# EAGLE design 0HP 0ttenuator Final (EAGLE 9.2.0)
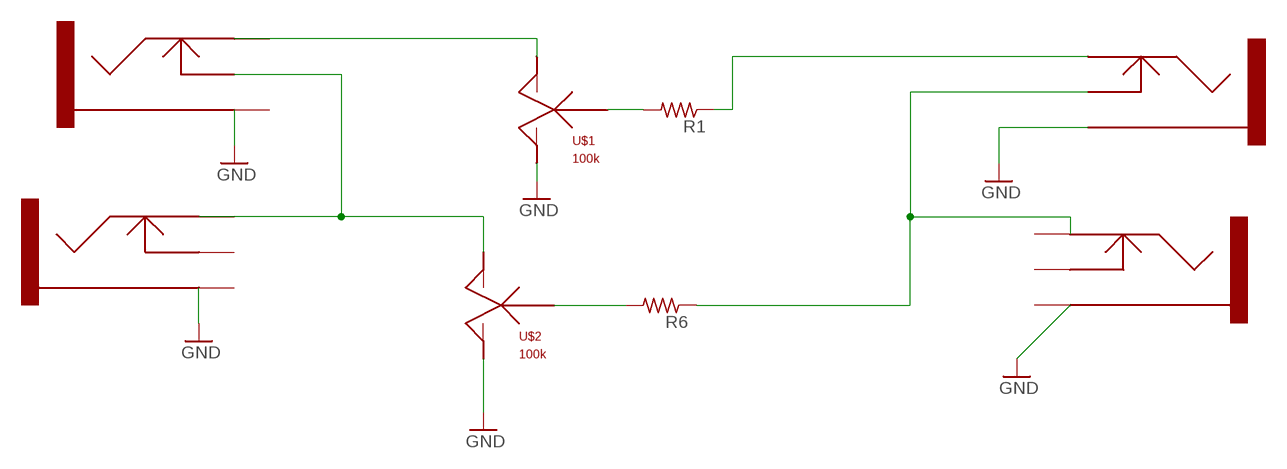
[diagram p0: schematic, sheet 1]

## Parts
CV1  3.5MMJACK  [3.5MMPHONEJACK]
CV2  3.5MMJACK  [3.5MMPHONEJACK]
IN  3.5MMJACK  [3.5MMPHONEJACK]
OUT  3.5MMJACK  [3.5MMPHONEJACK]
R1  R-US_0207/10  [0207/10]
R6  R-US_0207/10  [0207/10]
U$1  100k  ALPHAPOT_BOARDMOUNT  [ALPHAPOT_BOARDMOUNT]
U$2  100k  ALPHAPOT_BOARDMOUNT  [ALPHAPOT_BOARDMOUNT]

## Nets
GND: CV1.SLEEVE CV2.SLEEVE IN.SLEEVE OUT.SLEEVE U$1.RIGHT U$2.RIGHT
N$2: CV2.TIP U$1.LEFT
N$3: R1.2 U$1.MID
N$5: CV1.TIP CV2.SWITCH U$2.LEFT
N$6: OUT.TIP R1.1
N$7: IN.TIP OUT.SWITCH R6.1
N$8: R6.2 U$2.MID
Unconnected: CV1.SWITCH IN.SWITCH

## Library data of the parts
CV1 CV2 IN OUT = elipech_modified:3.5MMJACK
R1 R6 = rcl:R-US_: RESISTOR, American symbol; SPICEPREFIX: R
U$1 U$2 = elipech_modified:ALPHAPOT_BOARDMOUNT

## Board
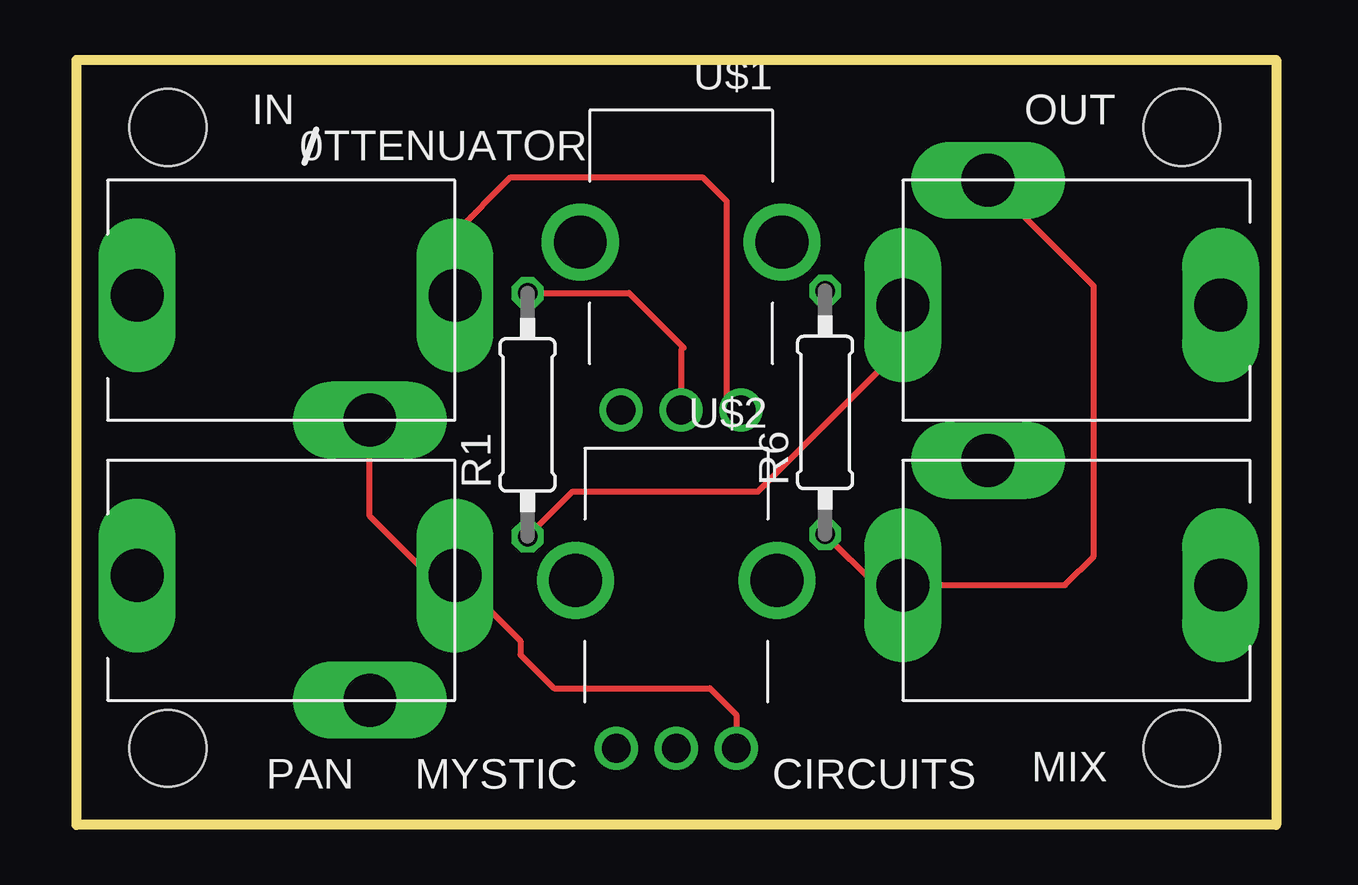
[diagram p1: board, top side]
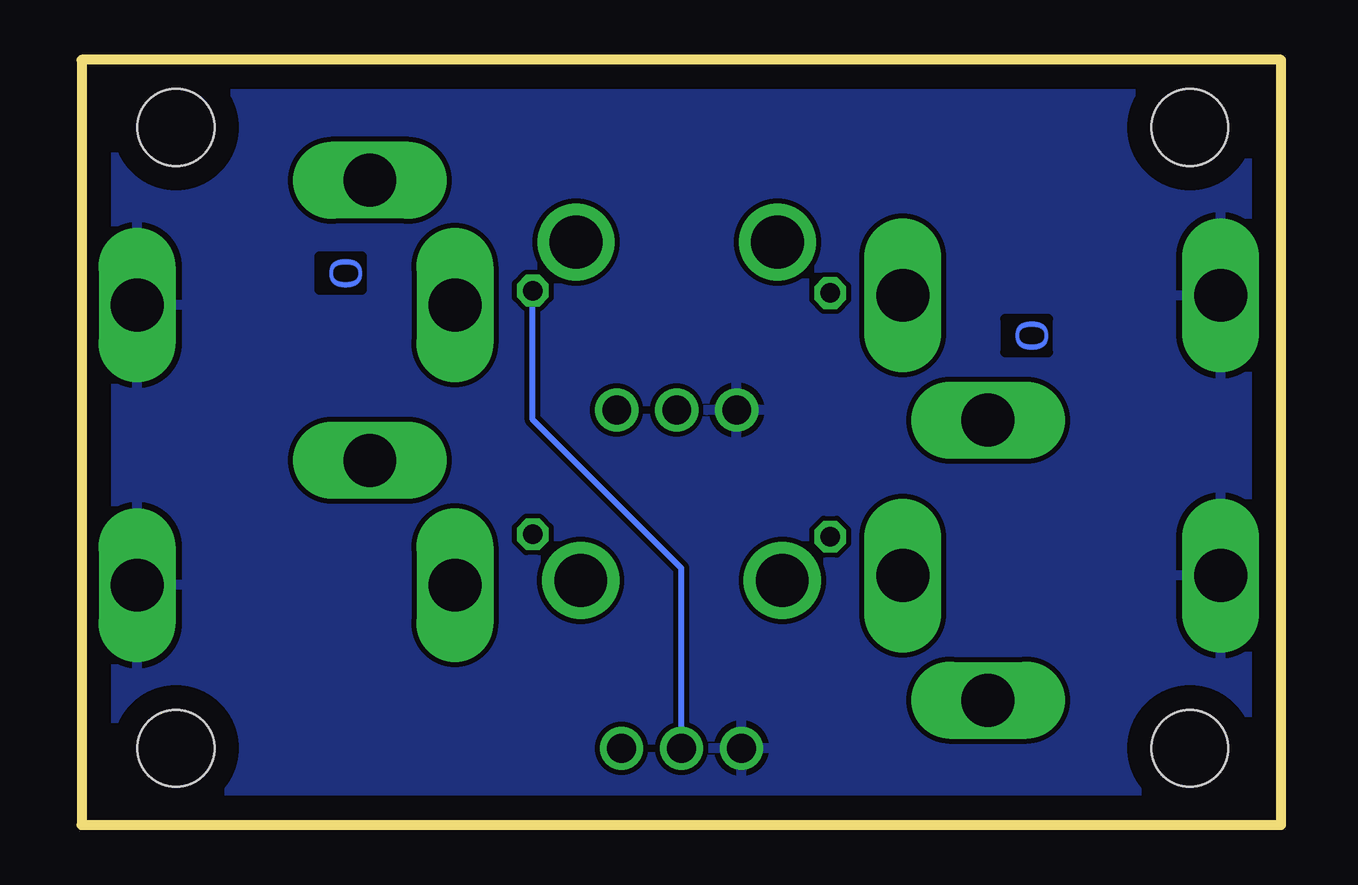
[diagram p2: board, bottom side, seen from below]

Size 50 x 31.89 mm. Coordinates in mm from the lower left corner, seen from the top.
Outline: 0,0 0,31.89 50,31.89 50,0 0,0
Copper layers (1*16): Top 0.035mm / dielectric 1.5mm / Bottom 0.035mm
Design rules "default": minimum track width 10mil, minimum drill 24mil, track to track 8mil, track to pad 8mil, pad to pad 8mil, via to via 8mil, smd to smd 8mil, copper to edge 40mil, drill to drill 8mil, minimum pad ring 10mil, minimum via ring 8mil, stop-mask expansion 4mil, vias tented up to drill 0mil, thermal gap 10mil
Holes 3.2 mm at 3.81,3.2 46.08,3.2 46.08,29.08 3.81,29.08

### Footprints (pad centres in the part's own frame; a part is rotated, then mirrored left to right if it is on the bottom)
3.5MMPHONEJACK = drill 2.2 pad 2.54 long: SLEEVE -5,0.2; SWITCH 4.7,-5; TIP 8.25,0.2
0207/10 = drill 0.813 octagon: 1 -5.08,0; 2 5.08,0
ALPHAPOT_BOARDMOUNT = drill 1.2: LEFT -2.5,7; MID 0,7; RIGHT 2.5,7 | drill 2.2: LEFT-LEG -4.2,0; RIGHT-LEG 4.2,0

### Placement (x,y rotation side)
CV1  7.53,10.2 0 top
CV2  7.53,21.88 0 top
IN  42.69,10.2 180 top
OUT  42.69,21.88 180 top
R1  18.8,17.1 90 top
R6  31.2,17.2 90 top
U$1  25.2,24.3 180 top
U$2  25,10.2 180 top

### Tracks (layer width: path | path; a pad name or v marks a point on that pad's centre or on a via)
GND
  pour Bottom: 0.28,0.14 0.1,31.87 50.1,31.62 50,0
N$2
  Top 0.254: CV2.TIP 15.78,24.68 18.1,27 26.1,27 27.1,26 27.1,17.9 U$1.LEFT
N$3
  Top 0.254: R1.2 23.02,22.18 25.3,19.9 25.2,19.8 U$1.MID
N$5
  Top 0.254: U$2.LEFT 27.5,4.6 26.4,5.7 19.9,5.7 18.5,7.1 18.5,7.67 CV1.TIP 14.7,10.4 12.22,12.88 CV2.SWITCH
N$6
  Top 0.254: R1.1 20.68,13.9 28.4,13.9 34.44,19.94 OUT.TIP
N$7
  Top 0.254: R6.1 33.32,10 IN.TIP 41.2,10 42.4,11.2 42.4,22.47 OUT.SWITCH
N$8
  Bottom 0.254: U$2.MID 25,10.7 31.2,16.9 R6.2

### Text on the board
Bottom: o | o
tPlace: IN | OUT | 0TTENUATOR | PAN | MYSTIC | CIRCUITS | MIX